# Altium schematic sheet 1_P1.schdoc
size 391 x 645 mm; Symbol: Drawing-Symbol_A4; Device: Drawing-Symbol_A4; @Project Name: Ai-Camera; @Page Count: 2; @Update Date: 2026-02-05; @Create Date: 2025-08-22; @Schematic Name: Schematic1; @Page No: 1; @Page Name: P1; Company: EasyEDA.com; Version: V1.0; Page Size: A4; @Create Time: 04:24:12; @Update Time: 10:58:01; Width: 1500; Height: 2500; Region Start: 1; X Region Count: 6; Y Region Count: 4; Blade Width: 10; Title Block Position: 3; @Board Name: Board1
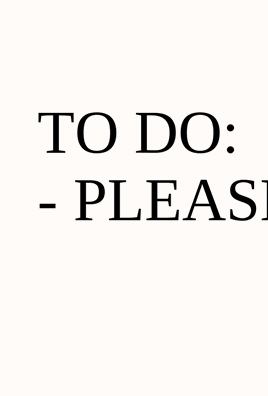
[diagram p0: 1_P1.schdoc, top left]
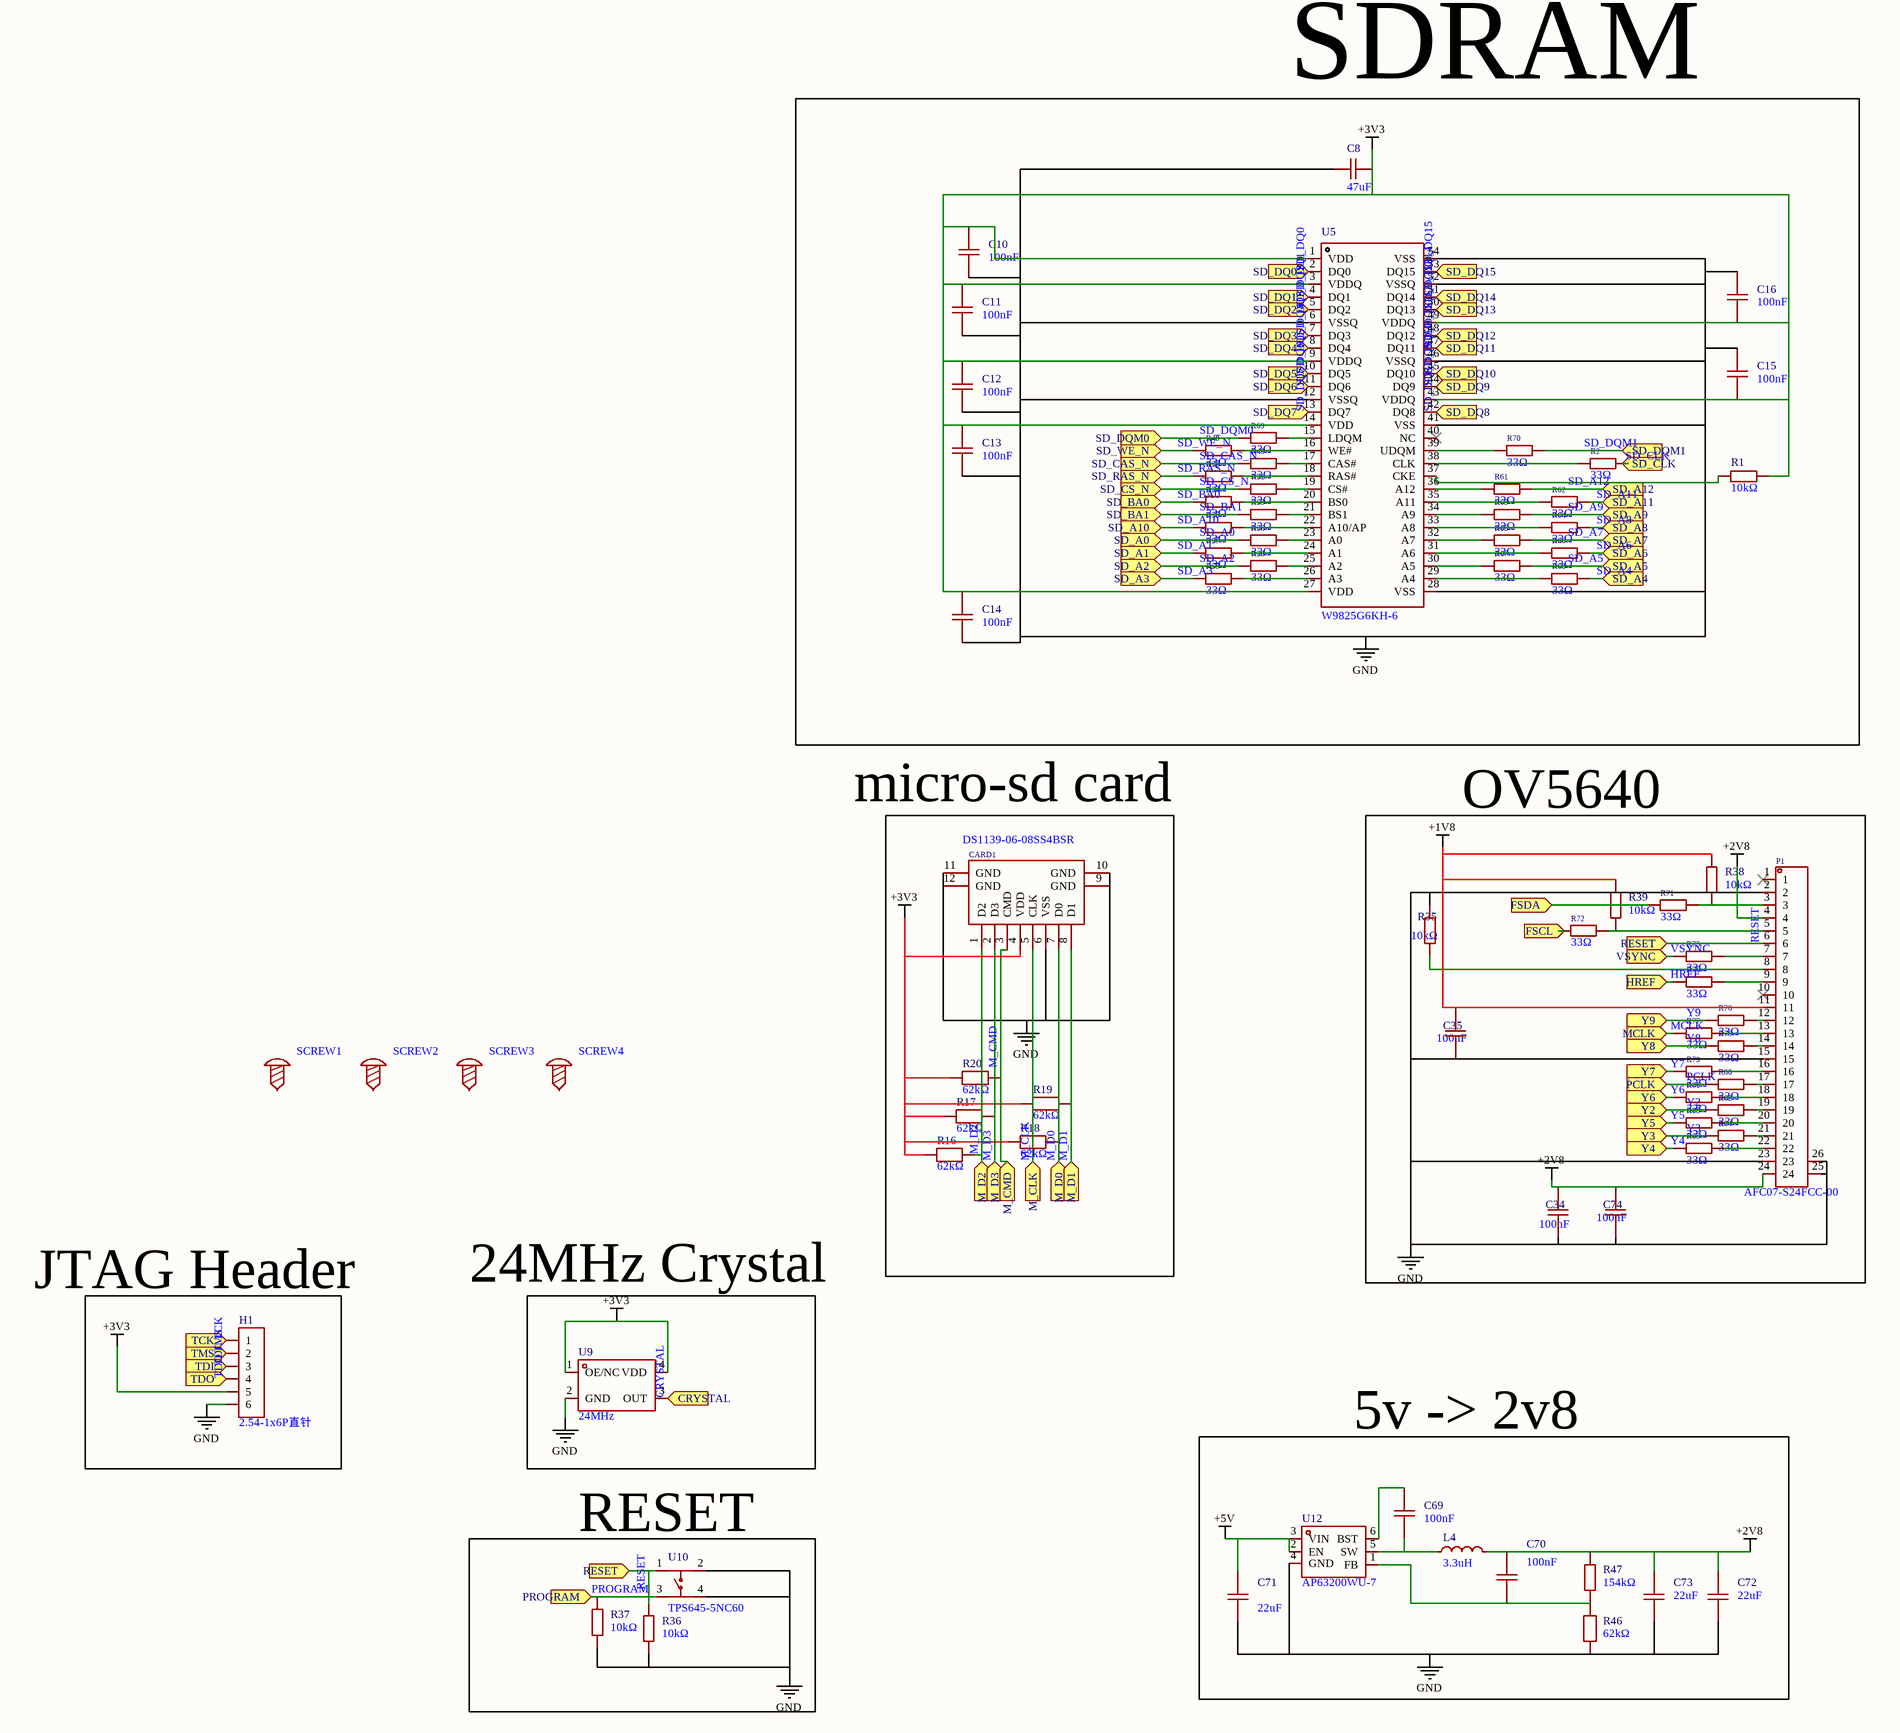
[diagram p1: 1_P1.schdoc, top right]
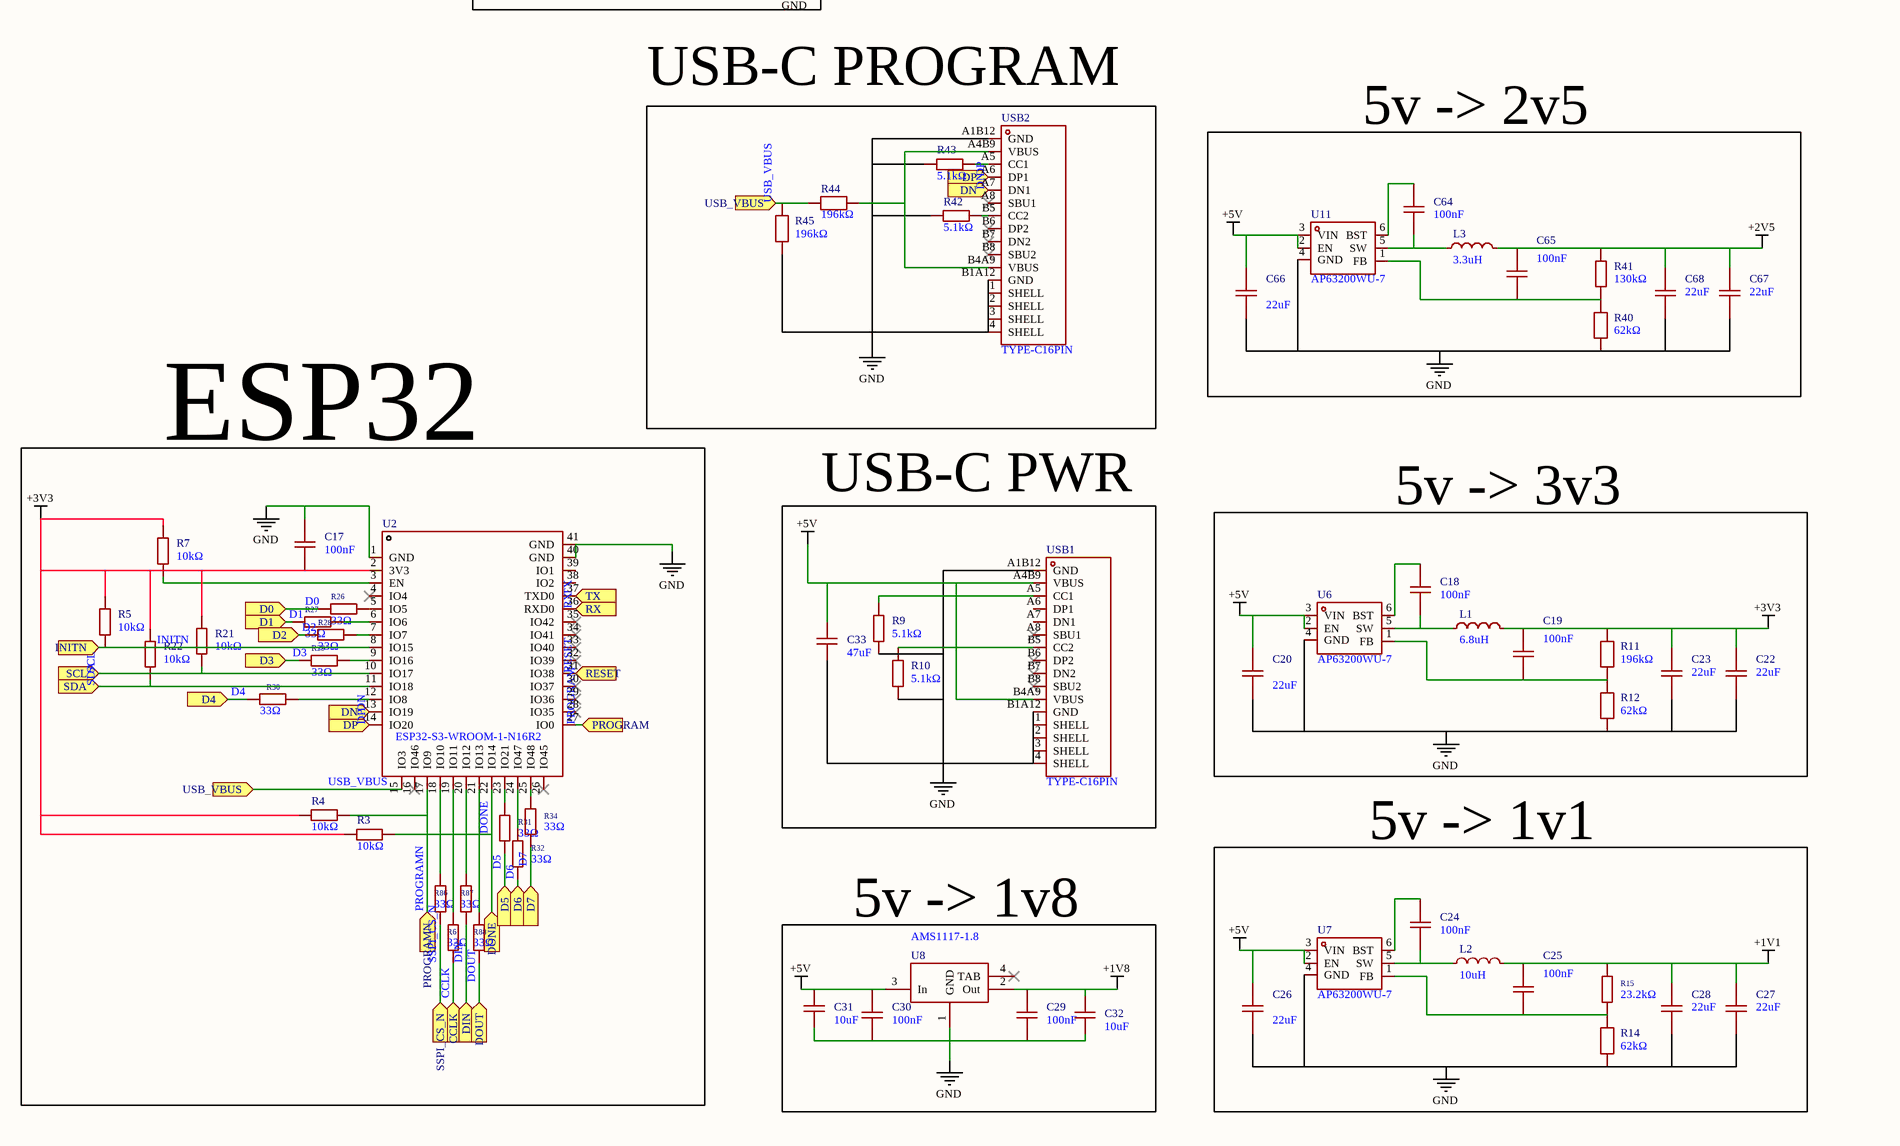
[diagram p2: 1_P1.schdoc, bottom right]

## Parts
C8  47uF  [C0805]
C10  100nF  [C01005]
C11  100nF  [C01005]
C12  100nF  [C01005]
C13  100nF  [C01005]
C14  100nF  [C01005]
C15  100nF  [C01005]
C16  100nF  [C01005]
C17  100nF  [C01005]
C18  100nF  [C01005]
C19  100nF  [C0603]
C20  22uF  [C0603]
C22  22uF  [C0603]
C23  22uF  [C0603]
C24  100nF  [C01005]
C25  100nF  [C0603]
C26  22uF  [C0603]
C27  22uF  [C0603]
C28  22uF  [C0603]
C29  100nF  [C01005]
C30  100nF  [C01005]
C31  10uF  [C0402]
C32  10uF  [C0402]
C33  47uF  [C0805]
C34  100nF  [C01005]
C35  100nF  [C01005]
C64  100nF  [C01005]
C65  100nF  [C0603]
C66  22uF  [C0603]
C67  22uF  [C0603]
C68  22uF  [C0603]
C69  100nF  [C01005]
C70  100nF  [C0603]
C71  22uF  [C0603]
C72  22uF  [C0603]
C73  22uF  [C0603]
C74  100nF  [C01005]
CARD1  DS1139-06-08SS4BSR  [TF-SMD_DS1139-06-08SS4BSR]
H1  2.54-1x6P直针  [HDR-TH_6P-P2.54-V-M-1]
L1  6.8uH  [IND-SMD_L7.0-W6.6]
L2  10uH  [IND-SMD_L7.3-W6.8]
L3  3.3uH  [IND-SMD_L4.5-W4.1_SL0420]
L4  3.3uH  [IND-SMD_L4.5-W4.1_SL0420]
P1  AFC07-S24FCC-00  [FPC-SMD_AFC07-S24FCC-00]
R1  10kΩ  [R0402]
R2  33Ω  [R0402]
R3  10kΩ  [R0402]
R4  10kΩ  [R0402]
R5  10kΩ  [R0402]
R6  33Ω  [R0402]
R7  10kΩ  [R0402]
R9  5.1kΩ  [R0603]
R10  5.1kΩ  [R0603]
R11  196kΩ  [R0603]
R12  62kΩ  [R0603]
R14  62kΩ  [R0603]
R15  23.2kΩ  [R0603]
R16  62kΩ  [R0603]
R17  62kΩ  [R0603]
R18  62kΩ  [R0603]
R19  62kΩ  [R0603]
R20  62kΩ  [R0603]
R21  10kΩ  [R0402]
R22  10kΩ  [R0402]
R26  33Ω  [R0402]
R27  33Ω  [R0402]
R28  33Ω  [R0402]
R29  33Ω  [R0402]
R30  33Ω  [R0402]
R31  33Ω  [R0402]
R32  33Ω  [R0402]
R34  33Ω  [R0402]
R35  10kΩ  [R0402]
R36  10kΩ  [R0402]
R37  10kΩ  [R0402]
R38  10kΩ  [R0402]
R39  10kΩ  [R0402]
R40  62kΩ  [R0603]
R41  130kΩ  [R0402]
R42  5.1kΩ  [R0603]
R43  5.1kΩ  [R0603]
R44  196kΩ  [R0603]
R45  196kΩ  [R0603]
R46  62kΩ  [R0603]
R47  154kΩ  [R0402]
R48  33Ω  [R0402]
R49  33Ω  [R0402]
R50  33Ω  [R0402]
R51  33Ω  [R0402]
R53  33Ω  [R0402]
R54  33Ω  [R0402]
R55  33Ω  [R0402]
R56  33Ω  [R0402]
R57  33Ω  [R0402]
R58  33Ω  [R0402]
R59  33Ω  [R0402]
R61  33Ω  [R0402]
R62  33Ω  [R0402]
R63  33Ω  [R0402]
R64  33Ω  [R0402]
R65  33Ω  [R0402]
R66  33Ω  [R0402]
R67  33Ω  [R0402]
R68  33Ω  [R0402]
R69  33Ω  [R0402]
R70  33Ω  [R0402]
R71  33Ω  [R0402]
R72  33Ω  [R0402]
R73  33Ω  [R0402]
R75  33Ω  [R0402]
R76  33Ω  [R0402]
R77  33Ω  [R0402]
R78  33Ω  [R0402]
R79  33Ω  [R0402]
R80  33Ω  [R0402]
R81  33Ω  [R0402]
R82  33Ω  [R0402]
R83  33Ω  [R0402]
R84  33Ω  [R0402]
R85  33Ω  [R0402]
R86  33Ω  [R0402]
R87  33Ω  [R0402]
R88  33Ω  [R0402]
SCREW1  (no value)  [Screw-Hole-M2]
SCREW2  (no value)  [Screw-Hole-M3]
SCREW3  (no value)  [Screw-Hole-M3]
SCREW4  (no value)  [Screw-Hole-M3]
U2  ESP32-S3-WROOM-1-N16R2  [WIRELM-SMD_ESP32-S3-WROOM-1]
U5  W9825G6KH-6  [TSOP-54_L22.2-W10.2-P0.80-LS11.8-BL]
U6  AP63200WU-7  [SOT-23-6_L2.9-W1.6-P0.95-LS2.8-BR]
U7  AP63200WU-7  [SOT-23-6_L2.9-W1.6-P0.95-LS2.8-BR]
U8  AMS1117-1.8  [SOT-223-4_L6.5-W3.5-P2.30-LS7.0-BR]
U9  24MHz  [OSC-SMD_4P-L3.2-W2.5-BL]
U10  TPS645-5NC60  [SW-SMD_4P-L6.0-W6.0-P4.50-LS9.2]
U11  AP63200WU-7  [SOT-23-6_L2.9-W1.6-P0.95-LS2.8-BR]
U12  AP63200WU-7  [SOT-23-6_L2.9-W1.6-P0.95-LS2.8-BR]
USB1  TYPE-C16PIN  [USB-C-SMD_TYPE-C16PIN]
USB2  TYPE-C16PIN  [USB-C-SMD_TYPE-C16PIN]

## Blocks framed on the sheet
SDRAM: C8 C10-C16 R1 R2 R48-R51 R53-R59 R61-R70 U5
OV5640: C34 C35 C74 P1 R35 R38 R39 R71-R73 R75-R85
5v -> 2v8: C69-C73 L4 R46 R47 U12
RESET: R36 R37 U10
USB-C PROGRAM: R42-R45 USB2
5v -> 2v5: C64-C68 L3 R40 R41 U11
ESP32: C17 R3-R7 R21 R22 R26-R32 R34 R86-R88 U2
USB-C PWR: C33 R9 R10 USB1
5v -> 3v3: C18-C20 C22 C23 L1 R11 R12 U6
5v -> 1v1: C24-C28 L2 R14 R15 U7
5v -> 1v8: C29-C32 U8

## Ports
CCLK (in), CRYSTAL (in), D0 (in), D1 (in), D2 (in), D3 (in), D4 (in), D5 (in), D6 (in), D7 (in), DIN (in), DN (in), DONE (in), DOUT (in), DP (in), FSCL (in), FSDA (in), HREF (in), INITN (in), M_CLK (in), M_CMD (in), M_D0 (in), M_D1 (in), M_D2 (in), M_D3 (in), MCLK (in), PCLK (in), PROGRAM (in), PROGRAMN (in), RESET (in), RX (in), SCL (in), SD_A0 (in), SD_A1 (in), SD_A2 (in), SD_A3 (in), SD_A4 (in), SD_A5 (in), SD_A6 (in), SD_A7 (in), SD_A8 (in), SD_A9 (in), SD_A10 (in), SD_A11 (in), SD_A12 (in), SD_BA0 (in), SD_BA1 (in), SD_CAS_N (in), SD_CLK (in), SD_CS_N (in), SD_DQ0 (in), SD_DQ1 (in), SD_DQ2 (in), SD_DQ3 (in), SD_DQ4 (in), SD_DQ5 (in), SD_DQ6 (in), SD_DQ7 (in), SD_DQ8 (in), SD_DQ9 (in), SD_DQ10 (in), SD_DQ11 (in), SD_DQ12 (in), SD_DQ13 (in), SD_DQ14 (in), SD_DQ15 (in), SD_DQM0 (in), SD_DQM1 (in), SD_RAS_N (in), SD_WE_N (in), SDA (in), SSPI_CS_N (in), TCK (in), TDI (in), TDO (in), TMS (in), TX (in), USB_VBUS (in), VSYNC (in), Y2 (in), Y3 (in), Y4 (in), Y5 (in), Y6 (in), Y7 (in), Y8 (in), Y9 (in)

## Nets
+1V1: C25.2 C27.2 C28.2 L2.2 R15.2
+1V8: C29.1 C32.2 C35.1 P1.11 R38.2 R39.2 U8.2(Out)
+2V5: C65.2 C67.2 C68.2 L3.2 R41.2
+2V8: C34.1 C70.2 C72.2 C73.2 C74.1 L4.2 P1.4 P1.24 R47.2
+3V3: C8.1 C10.1 C11.1 C12.1 C13.1 C14.1 C15.2 C16.2 C17.2 C19.2 C22.2 C23.2 CARD1.4(VDD) H1.5 L1.2 R1.2 R3.1 R4.1 R5.2 R7.2 R11.2 R16.2 R17.2 R18.2 R19.2 R20.2 R21.2 R22.2 U2.2(3V3) U5.1(VDD) U5.3(VDDQ) U5.9(VDDQ) U5.14(VDD) U5.27(VDD) U5.43(VDDQ) U5.49(VDDQ) U9.1(OE/NC) U9.4(VDD)
+5V: C20.2 C26.2 C30.1 C31.2 C33.2 C66.2 C71.2 U6.2(EN) U6.3(VIN) U7.2(EN) U7.3(VIN) U8.3(In) U11.2(EN) U11.3(VIN) U12.2(EN) U12.3(VIN) USB1.A4B9(VBUS) USB1.B4A9(VBUS)
GND: C8.2 C10.2 C11.2 C12.2 C13.2 C14.2 C15.1 C16.1 C17.1 C20.1 C22.1 C23.1 C26.1 C27.1 C28.1 C33.1 C34.2 C35.2 C66.1 C67.1 C68.1 C71.1 C72.1 C73.1 C74.2 CARD1.6(VSS) CARD1.9(GND) CARD1.10(GND) CARD1.11(GND) CARD1.12(GND) H1.6 P1.2 P1.15 P1.23 P1.25 P1.26 R9.1 R10.1 R12.1 R14.1 R35.2 R36.2 R37.2 R40.1 R42.2 R43.2 R45.1 R46.1 U2.1(GND) U2.40(GND) U2.41(GND) U5.6(VSSQ) U5.12(VSSQ) U5.28(VSS) U5.41(VSS) U5.46(VSSQ) U5.52(VSSQ) U5.54(VSS) U6.4(GND) U7.4(GND) U8.1(GND) U9.2(GND) U10.2 U10.4 U11.4(GND) U12.4(GND) USB1.1(SHELL) USB1.2(SHELL) USB1.3(SHELL) USB1.4(SHELL) USB1.A1B12(GND) USB1.B1A12(GND) USB2.1(SHELL) USB2.2(SHELL) USB2.3(SHELL) USB2.4(SHELL) USB2.A1B12(GND) USB2.B1A12(GND)
CCLK: R6.1 ; port CCLK
CRYSTAL: U9.3(OUT) ; port CRYSTAL
D0: R26.1 ; port D0
D1: R27.1 ; port D1
D2: R28.1 ; port D2
D3: R29.1 ; port D3
D4: R30.1 ; port D4
D5: R31.1 ; port D5
D6: R32.1 ; port D6
D7: R34.1 ; port D7
DIN: R87.1 ; port DIN
DN: U2.13(IO19) USB2.A7(DN1) ; port DN
DONE: R3.2 U2.22(IO14) ; port DONE
DOUT: R88.1 ; port DOUT
DP: U2.14(IO20) USB2.A6(DP1) ; port DP
FSCL: R72.1 ; port FSCL
FSDA: R71.1 ; port FSDA
HREF: R75.1 ; port HREF
INITN: R5.1 U2.8(IO15) ; port INITN
M_CLK: CARD1.5(CLK) ; port M_CLK
M_CMD: CARD1.3(CMD) R20.1 ; port M_CMD
M_D0: CARD1.7(D0) R18.1 ; port M_D0
M_D1: CARD1.8(D1) R19.1 ; port M_D1
M_D2: CARD1.1(D2) R16.1 ; port M_D2
M_D3: CARD1.2(D3) R17.1 ; port M_D3
MCLK: R77.1 ; port MCLK
PCLK: R80.1 ; port PCLK
PROGRAM: R37.1 U2.27(IO0) U10.3 ; port PROGRAM
PROGRAMN: R4.2 U2.17(IO9) ; port PROGRAMN
RESET: P1.6 R36.1 U2.31(IO38) U10.1 ; port RESET
RX: U2.36(RXD0) ; port RX
SCL: R21.1 U2.10(IO17) ; port SCL
SD_A0: R56.1 ; port SD_A0
SD_A1: R57.1 ; port SD_A1
SD_A2: R58.1 ; port SD_A2
SD_A3: R59.1 ; port SD_A3
SD_A4: R68.2 ; port SD_A4
SD_A5: R67.2 ; port SD_A5
SD_A6: R66.2 ; port SD_A6
SD_A7: R65.2 ; port SD_A7
SD_A8: R64.2 ; port SD_A8
SD_A9: R63.2 ; port SD_A9
SD_A10: R55.1 ; port SD_A10
SD_A11: R62.2 ; port SD_A11
SD_A12: R61.2 ; port SD_A12
SD_BA0: R54.1 ; port SD_BA0
SD_BA1: R53.1 ; port SD_BA1
SD_CAS_N: R49.1 ; port SD_CAS_N
SD_CLK: R2.2 ; port SD_CLK
SD_CS_N: R51.1 ; port SD_CS_N
SD_DQ0: U5.2(DQ0) ; port SD_DQ0
SD_DQ1: U5.4(DQ1) ; port SD_DQ1
SD_DQ2: U5.5(DQ2) ; port SD_DQ2
SD_DQ3: U5.7(DQ3) ; port SD_DQ3
SD_DQ4: U5.8(DQ4) ; port SD_DQ4
SD_DQ5: U5.10(DQ5) ; port SD_DQ5
SD_DQ6: U5.11(DQ6) ; port SD_DQ6
SD_DQ7: U5.13(DQ7) ; port SD_DQ7
SD_DQ8: U5.42(DQ8) ; port SD_DQ8
SD_DQ9: U5.44(DQ9) ; port SD_DQ9
SD_DQ10: U5.45(DQ10) ; port SD_DQ10
SD_DQ11: U5.47(DQ11) ; port SD_DQ11
SD_DQ12: U5.48(DQ12) ; port SD_DQ12
SD_DQ13: U5.50(DQ13) ; port SD_DQ13
SD_DQ14: U5.51(DQ14) ; port SD_DQ14
SD_DQ15: U5.53(DQ15) ; port SD_DQ15
SD_DQM0: R69.1 ; port SD_DQM0
SD_DQM1: R70.2 ; port SD_DQM1
SD_RAS_N: R50.1 ; port SD_RAS_N
SD_WE_N: R48.1 ; port SD_WE_N
SDA: R22.1 U2.11(IO18) ; port SDA
SSPI_CS_N: R86.1 ; port SSPI_CS_N
TCK: H1.1 ; port TCK
TDI: H1.3 ; port TDI
TDO: H1.4 ; port TDO
TMS: H1.2 ; port TMS
TX: U2.37(TXD0) ; port TX
USB_VBUS: R44.1 R45.2 U2.15(IO3) ; port USB_VBUS
VSYNC: R73.1 ; port VSYNC
Y2: R82.1 ; port Y2
Y3: R84.1 ; port Y3
Y4: R85.1 ; port Y4
Y5: R83.1 ; port Y5
Y6: R81.1 ; port Y6
Y7: R79.1 ; port Y7
Y8: R78.1 ; port Y8
Y9: R76.1 ; port Y9
NetC18_1: C18.1 U6.6(BST)
NetC18_2: C18.2 L1.1 U6.5(SW)
NetC19_1: C19.1 R11.1 R12.2 U6.1(FB)
NetC24_1: C24.1 U7.6(BST)
NetC24_2: C24.2 L2.1 U7.5(SW)
NetC25_1: C25.1 R14.2 R15.1 U7.1(FB)
NetC29_2: C29.2 C30.2 C31.1 C32.1
NetC64_1: C64.1 U11.6(BST)
NetC64_2: C64.2 L3.1 U11.5(SW)
NetC65_1: C65.1 R40.2 R41.1 U11.1(FB)
NetC69_1: C69.1 U12.6(BST)
NetC69_2: C69.2 L4.1 U12.5(SW)
NetC70_1: C70.1 R46.2 R47.1 U12.1(FB)
NetP1_3: P1.3 R38.1 R71.2
NetP1_5: P1.5 R39.1 R72.2
NetP1_7: P1.7 R73.2
NetP1_8: P1.8 R35.1
NetP1_9: P1.9 R75.2
NetP1_12: P1.12 R76.2
NetP1_13: P1.13 R77.2
NetP1_14: P1.14 R78.2
NetP1_16: P1.16 R79.2
NetP1_17: P1.17 R80.2
NetP1_18: P1.18 R81.2
NetP1_19: P1.19 R82.2
NetP1_20: P1.20 R83.2
NetP1_21: P1.21 R84.2
NetP1_22: P1.22 R85.2
NetR1_1: R1.1 U5.37(CKE)
NetR2_1: R2.1 U5.38(CLK)
NetR6_2: R6.2 U2.19(IO11)
NetR7_1: R7.1 U2.3(EN)
NetR9_2: R9.2 USB1.A5(CC1)
NetR10_2: R10.2 USB1.B5(CC2)
NetR26_2: R26.2 U2.5(IO5)
NetR27_2: R27.2 U2.6(IO6)
NetR28_2: R28.2 U2.7(IO7)
NetR29_2: R29.2 U2.9(IO16)
NetR30_2: R30.2 U2.12(IO8)
NetR31_2: R31.2 U2.23(IO21)
NetR32_2: R32.2 U2.24(IO47)
NetR34_2: R34.2 U2.25(IO48)
NetR42_1: R42.1 USB2.B5(CC2)
NetR43_1: R43.1 USB2.A5(CC1)
NetR44_2: R44.2 USB2.A4B9(VBUS) USB2.B4A9(VBUS)
NetR48_2: R48.2 U5.16(WE#)
NetR49_2: R49.2 U5.17(CAS#)
NetR50_2: R50.2 U5.18(RAS#)
NetR51_2: R51.2 U5.19(CS#)
NetR53_2: R53.2 U5.21(BS1)
NetR54_2: R54.2 U5.20(BS0)
NetR55_2: R55.2 U5.22(A10/AP)
NetR56_2: R56.2 U5.23(A0)
NetR57_2: R57.2 U5.24(A1)
NetR58_2: R58.2 U5.25(A2)
NetR59_2: R59.2 U5.26(A3)
NetR61_1: R61.1 U5.36(A12)
NetR62_1: R62.1 U5.35(A11)
NetR63_1: R63.1 U5.34(A9)
NetR64_1: R64.1 U5.33(A8)
NetR65_1: R65.1 U5.32(A7)
NetR66_1: R66.1 U5.31(A6)
NetR67_1: R67.1 U5.30(A5)
NetR68_1: R68.1 U5.29(A4)
NetR69_2: R69.2 U5.15(LDQM)
NetR70_1: R70.1 U5.39(UDQM)
NetR86_2: R86.2 U2.18(IO10)
NetR87_2: R87.2 U2.20(IO12)
NetR88_2: R88.2 U2.21(IO13)

Not connected (* = marked no-connect by the designer): P1 1* 10*; SCREW1 1; SCREW2 1; SCREW3 1; SCREW4 1; U2 4(IO4)* 16(IO46)* 26(IO45)* 28(IO35)* 29(IO36)* 30(IO37)* 32(IO39)* 33(IO40)* 34(IO41)* 35(IO42)* 38(IO2) 39(IO1); U5 40(NC)*; U8 4(TAB)*; USB1 A6(DP1) A7(DN1) A8(SBU1)* B6(DP2)* B7(DN2)* B8(SBU2)*; USB2 A8(SBU1)* B6(DP2)* B7(DN2)* B8(SBU2)*

## Notes on the sheet
- TO DO:
  - PLEASE CHECK THE POWER ON FPGA
- micro-sd card
- (near H1) JTAG Header
- 24MHz Crystal
- 1
- 2
- 3
- 4
- 5
- 6
- A
- B
- C
- D
- Schematic
- Schematic1
- Create at
- Update at
- 2025-08-22
- 2026-02-05
- Board
- Drawn
- Board1
- Page
- P1
- Reviewed
- Version
- Size
- Ai-Camera
- Page  1  Total  2
- V1.0
- A4
- EasyEDA.com

## Library data of the parts
C8 C33 = CL21A476MQYNNNE: Manufacturer: SAMSUNG(三星); Add into BOM: yes; Tolerance: ±20%; Voltage Rating: 6.3V; Temperature Coefficient: X5R; Symbol: CL21A476MQYNNNE; Device: CL21A476MQYNNNE; LCSC Part Name: 47uF ±20% 6.3V; Supplier Part: C16780; Manufacturer Part: CL21A476MQYNNNE; Supplier Footprint: 0805; JLCPCB Part Class: Basic Part; Datasheet: https://item.szlcsc.com/datasheet/CL21A476MQYNNNE/17464.html; Supplier: LCSC; Convert to PCB: yes; Value: 47uF
C10-C18 C24 C29 C30 C34 C35 C64 C69 C74 = GRM022R60J104KE15D: Manufacturer: muRata(村田); Add into BOM: yes; Tolerance: ±10%; Voltage Rating: 6.3V; Temperature Coefficient: X5R; Symbol: GRM022R60J104KE15D; Device: GRM022R60J104KE15D; LCSC Part Name: 100nF ±10% 6.3V; Supplier Part: C161362; Manufacturer Part: GRM022R60J104KE15D; Supplier Footprint: 01005; JLCPCB Part Class: Extended Part; Datasheet: https://atta.szlcsc.com/upload/public/pdf/source/20200305/C490387_23319AE8C154DEB24C505E6C82A8106A.pdf; Supplier: LCSC; Convert to PCB: yes; Value: 100nF
C19 C25 C65 C70 = TCC0603X7R104K500CT: Manufacturer: CCTC(三环); Add into BOM: yes; Tolerance: ±10%; Voltage Rating: 50V; Temperature Coefficient: X7R; Symbol: TCC0603X7R104K500CT; Device: TCC0603X7R104K500CT; LCSC Part Name: 100nF ±10% 50V; Supplier Part: C282519; Manufacturer Part: TCC0603X7R104K500CT; Supplier Footprint: 0603; JLCPCB Part Class: Extended Part; Datasheet: https://item.szlcsc.com/datasheet/TCC0603X7R104K500CT/268639.html; Supplier: LCSC; Convert to PCB: yes; Value: 100nF
C20 C22 C23 C26-C28 C66-C68 C71-C73 = TCC0603X5R226M6R3CT: Manufacturer: CCTC(三环); Add into BOM: yes; Tolerance: ±20%; Voltage Rating: 6.3V; Temperature Coefficient: X5R; Symbol: TCC0603X5R226M6R3CT; Device: TCC0603X5R226M6R3CT; LCSC Part Name: 22uF ±20% 6.3V; Supplier Part: C380323; Manufacturer Part: TCC0603X5R226M6R3CT; Supplier Footprint: 0603; JLCPCB Part Class: Extended Part; Datasheet: https://item.szlcsc.com/datasheet/TCC0603X5R226M6R3CT/352728.html; Supplier: LCSC; Convert to PCB: yes; Value: 22uF
C31 C32 = GRM155R60J106ME44D: Manufacturer: muRata(村田); Add into BOM: yes; Tolerance: ±20%; Voltage Rating: 6.3V; Temperature Coefficient: X5R; Symbol: GRM155R60J106ME44D; Device: GRM155R60J106ME44D; LCSC Part Name: 10uF ±20% 6.3V; Supplier Part: C76991; Manufacturer Part: GRM155R60J106ME44D; Supplier Footprint: 0402; JLCPCB Part Class: Extended Part; Datasheet: https://item.szlcsc.com/datasheet/GRM155R60J106ME44D/78118.html; Supplier: LCSC; Convert to PCB: yes; Value: 10uF
CARD1 = DS1139-06-08SS4BSR: Manufacturer: CONNFLY; Add into BOM: yes; Card Connection Mode: Hinged Lid; Card Type: MicroSD Card (TF Card); Connector Type: Connector and Ejector; Symbol: DS1139-06-08SS4BSR; Device: DS1139-06-08SS4BSR; Supplier: LCSC; Manufacturer Part: DS1139-06-08SS4BSR; Supplier Part: C86574; JLCPCB Part Class: Extended Part; LCSC Part Name: 翻盖式 MicroSD卡(TF卡) 卡座; Supplier Footprint: SMD; Datasheet: https://item.szlcsc.com/datasheet/DS1139-06-08SS4BSR/87751.html; Convert to PCB: yes; Height Above Board: -; Operating Temperature: -
H1 = 2.54-1x6P直针: Manufacturer: BOOMELE(博穆精密); Symbol: Header-Male-2.54_1x6; Add into BOM: yes; Pin Structure: 1x6P; Pitch: 2.54mm; Circluar Pins/Square Pins: Pin Header; Current Rating: 3A; Device: 2.54-1x6P直针; LCSC Part Name: 1x6P 间距:2.54mm 方针 直插; Supplier Part: C37208; Manufacturer Part: 2.54-1x6P直针; Supplier Footprint: 插件,P=2.54mm; JLCPCB Part Class: Extended Part; Datasheet: https://item.szlcsc.com/datasheet/2.54-1x6P%25E7%259B%25B4%25E9%2592%2588/38187.html; Supplier: LCSC; Convert to PCB: yes; Row Spacing: -; Mounting Type: Through Hole; Number of Rows: 1; Number of Pins: 6P; Voltage Rating (Max): -; Length of Mating Pin: 6mm; Insulation Height: 2.5mm; Length of End Connection Pin: 3mm; Contact Material: Brass; Contact Plating: Gold; Operating Temperature: -40℃~+105℃; Color: Black
L1 = FXL0630-6R8-M: Manufacturer: cjiang(长江微电); Add into BOM: yes; Tolerance: ±20%; Current Rating: 5A; Current - Saturation(Isat): 6A; DC Resistance(DCR): 48mΩ; Type: Molded Inductor; Symbol: FXL0630-6R8-M; Device: FXL0630-6R8-M; LCSC Part Name: 6.8uH ±20% 6A; Supplier Part: C167221; Manufacturer Part: FXL0630-6R8-M; Supplier Footprint: SMD,7x6.6mm; JLCPCB Part Class: Extended Part; Datasheet: https://item.szlcsc.com/datasheet/FXL0630-6R8-M/178604.html; Supplier: LCSC; Convert to PCB: yes; Value: 6.8uH
L2 = FXL0630-100-M: Manufacturer: cjiang(长江微电); Add into BOM: yes; Tolerance: ±20%; Saturation Current (Isat): 5.5A; Type: Integrated molded inductor; Symbol: FXL0630-100-M; Device: FXL0630-100-M; LCSC Part Name: 10uH ±20% 5.5A; Supplier Part: C167223; Manufacturer Part: FXL0630-100-M; Supplier Footprint: SMD,6.6x7mm; JLCPCB Part Class: Extended Part; Datasheet: https://atta.szlcsc.com/upload/public/pdf/source/20240426/3189EA8206330E2108542F9E34E540E7.pdf; Supplier: LCSC; Convert to PCB: yes; Value: 10uH; Ratings: -
L3 L4 = SL0420-3R3M: Manufacturer: 台湾陆海; Add into BOM: yes; Tolerance: ±20%; Current Rating: 3.5A; Current - Saturation (Isat): 4A; Symbol: SL0420-3R3M; Device: SL0420-3R3M; LCSC Part Name: 3.3uH ±20% 4A; Supplier Part: C22463807; Manufacturer Part: SL0420-3R3M; Supplier Footprint: SMD,4.5x4.1mm; JLCPCB Part Class: Extended Part; Datasheet: https://item.szlcsc.com/datasheet/SL0420-3R3M/24154949.html; Supplier: LCSC; Convert to PCB: yes; Value: 3.3uH
P1 = AFC07-S24FCC-00: Manufacturer: JS(钜硕电子); Symbol: FPC 0.5MM 24P Pull type H2.0mm Under the next; Add into BOM: yes; Locking Feature: Slide Lock; Number of Contacts: 24P; Pitch: 0.5mm; FFC, FCB Thickness: 0.3mm; Device: AFC07-S24FCC-00; Supplier: LCSC; Manufacturer Part: AFC07-S24FCC-00; Supplier Part: C11057; JLCPCB Part Class: Extended Part; LCSC Part Name: 间距:0.5mm P数:24P 抽屉式 下接; Supplier Footprint: SMD,P=0.5mm,卧贴; Datasheet: https://item.szlcsc.com/datasheet/AFC07-S24FCC-00/11604.html; Convert to PCB: yes; Contact Type: Bottom Contact; Mounting Type: Surface Mount, Right Angle; Height Above Board: 2mm
R1 R3-R5 R7 R21 R22 R35-R39 = 0402WGF1002TCE: Manufacturer: UNI-ROYAL(厚声); Add into BOM: yes; Tolerance: ±1%; Power(Watts): 62.5mW; Voltage-Supply(Max): 50V; Temperature Coefficient: ±100ppm/℃; Symbol: 0402WGF1002TCE; Device: 0402WGF1002TCE; LCSC Part Name: 10kΩ ±1% 62.5mW 厚膜电阻; Supplier Part: C25744; Manufacturer Part: 0402WGF1002TCE; Supplier Footprint: 0402; JLCPCB Part Class: Basic Part; Datasheet: https://item.szlcsc.com/datasheet/0402WGF1002TCE/26487.html; Supplier: LCSC; Convert to PCB: yes; Type: Thick Film Resistor; Value: 10kΩ; Operating Temperature: -55℃~+155℃
R2 R6 R26-R32 R34 R48-R51 R53-R59 R61-R73 R75-R88 = 0402WGF330JTCE: Manufacturer: UNI-ROYAL(厚声); Add into BOM: yes; Tolerance: ±1%; Power(Watts): 62.5mW; Voltage-Supply(Max): 50V; Temperature Coefficient: ±100ppm/℃; Symbol: 0402WGF330JTCE; Device: 0402WGF330JTCE; Supplier: LCSC; Manufacturer Part: 0402WGF330JTCE; Supplier Part: C25105; Value: 33Ω; JLCPCB Part Class: Basic Part; LCSC Part Name: 33Ω ±1% 62.5mW 厚膜电阻; Supplier Footprint: 0402; Datasheet: https://item.szlcsc.com/datasheet/0402WGF330JTCE/25848.html; Convert to PCB: yes; Type: Thick Film Resistor; Operating Temperature: -55℃~+155℃
R9 R10 R42 R43 = 0603WAF5101T5E: Manufacturer: UNI-ROYAL(厚声); Add into BOM: yes; Tolerance: ±1%; Power(Watts): 100mW; Voltage-Supply(Max): 75V; Temperature Coefficient: ±100ppm/℃; Symbol: 0603WAF5101T5E; Device: 0603WAF5101T5E; LCSC Part Name: 5.1kΩ ±1% 100mW 厚膜电阻; Supplier Part: C23186; Manufacturer Part: 0603WAF5101T5E; Supplier Footprint: 0603; JLCPCB Part Class: Basic Part; Datasheet: https://item.szlcsc.com/datasheet/0603WAF5101T5E/23913.html; Supplier: LCSC; Convert to PCB: yes; Type: Thick Film Resistor; Value: 5.1kΩ; Operating Temperature: -55℃~+155℃
R11 R44 R45 = FRC0603F1963TS: Manufacturer: FOJAN(富捷); Add into BOM: yes; Tolerance: ±1%; Power(Watts): 100mW; Voltage-Supply(Max): 75V; Temperature Coefficient: ±100ppm/℃; Symbol: FRC0603F1963TS; Device: FRC0603F1963TS; LCSC Part Name: 196kΩ ±1% 100mW 厚膜电阻; Supplier Part: C2974032; Manufacturer Part: FRC0603F1963TS; Supplier Footprint: 0603; JLCPCB Part Class: Extended Part; Supplier: LCSC; Convert to PCB: yes; Type: Thick Film Resistor; Value: 196kΩ; Operating Temperature: -55℃~+155℃
R12 R14 R16-R20 R40 R46 = FRC0603F6202TS: Manufacturer: FOJAN(富捷); Add into BOM: yes; Tolerance: ±1%; Power(Watts): 100mW; Voltage-Supply(Max): 75V; Temperature Coefficient: ±100ppm/℃; Symbol: FRC0603F6202TS; Device: FRC0603F6202TS; LCSC Part Name: 62kΩ ±1% 100mW 厚膜电阻; Supplier Part: C2907059; Manufacturer Part: FRC0603F6202TS; Supplier Footprint: 0603; JLCPCB Part Class: Extended Part; Supplier: LCSC; Convert to PCB: yes; Type: Thick Film Resistor; Value: 62kΩ; Operating Temperature: -55℃~+155℃
R15 = 0603WAF2322T5E: Manufacturer: UNI-ROYAL(厚声); Add into BOM: yes; Tolerance: ±1%; Power(Watts): 100mW; Voltage-Supply(Max): 75V; Temperature Coefficient: ±100ppm/℃; Symbol: 0603WAF2322T5E; Device: 0603WAF2322T5E; Supplier: LCSC; Manufacturer Part: 0603WAF2322T5E; Supplier Part: C23346; Value: 23.2kΩ; JLCPCB Part Class: Extended Part; LCSC Part Name: 23.2kΩ ±1% 100mW 厚膜电阻; Supplier Footprint: 0603; Datasheet: https://item.szlcsc.com/datasheet/0603WAF2322T5E/24079.html; Convert to PCB: yes; Type: Thick Film Resistor; Operating Temperature: -55℃~+155℃
R41 = RC0402FR-07130KL: Manufacturer: YAGEO(国巨); Add into BOM: yes; Tolerance: ±1%; Power(Watts): 62.5mW; Voltage-Supply(Max): 50V; Temperature Coefficient: ±100ppm/℃; Symbol: RC0402FR-07130KL; Device: RC0402FR-07130KL; LCSC Part Name: 厚膜电阻 130kΩ ±1% 62.5mW; Supplier Part: C93946; Manufacturer Part: RC0402FR-07130KL; Supplier Footprint: 0402; JLCPCB Part Class: Extended Part; Datasheet: https://item.szlcsc.com/datasheet/RC0402FR-07130KL/95144.html; Supplier: LCSC; Convert to PCB: yes; Type: Thick Film Resistor; Value: 130kΩ; Operating Temperature: -55℃~+155℃
R47 = 0402WGF1543TCE: Manufacturer: UNI-ROYAL(厚声); Add into BOM: yes; Tolerance: ±1%; Power(Watts): 62.5mW; Voltage-Supply(Max): 50V; Temperature Coefficient: ±100ppm/℃; Symbol: 0402WGF1543TCE; Device: 0402WGF1543TCE; LCSC Part Name: 154kΩ ±1% 62.5mW 厚膜电阻; Supplier Part: C26993; Manufacturer Part: 0402WGF1543TCE; Supplier Footprint: 0402; JLCPCB Part Class: Extended Part; Datasheet: https://item.szlcsc.com/datasheet/0402WGF1543TCE/27742.html; Supplier: LCSC; Convert to PCB: yes; Type: Thick Film Resistor; Value: 154kΩ; Operating Temperature: -55℃~+155℃
SCREW1 = Screw-Hole-M2: Add into BOM: yes; Symbol: Screw-Hole; Device: Screw-Hole-M2; Convert to PCB: yes; Supplier Footprint: 插件
SCREW2-SCREW4 = Screw-Hole-M3: Convert to PCB: yes; Symbol: Screw-Hole; Device: Screw-Hole-M3; Add into BOM: yes; Supplier Footprint: 插件
U2 = ESP32-S3-WROOM-1-N16R2: Manufacturer: ESPRESSIF(乐鑫); Symbol: ESP32-S3-WROOM-1(N16R2); Add into BOM: yes; Device: ESP32-S3-WROOM-1-N16R2; LCSC Part Name: 通用型Wi-Fi+低功耗蓝牙MCU模组; Supplier Part: C2913205; Manufacturer Part: ESP32-S3-WROOM-1-N16R2; Supplier Footprint: SMD,25.5x18mm; JLCPCB Part Class: Extended Part; Datasheet: https://item.szlcsc.com/datasheet/ESP32-S3-WROOM-1-N16R2/3198303.html; Supplier: LCSC; Convert to PCB: yes
U5 = W9825G6KH-6: Manufacturer: Winbond(华邦); Add into BOM: yes; Memory Size: 256Mbit; Clock Frequency: 166MHz; Voltage - Supply: 3V~3.6V; Symbol: W9825G6KH-6; Device: W9825G6KH-6; LCSC Part Name: 4M×4存储体×16位SDRAM; Supplier Part: C62246; Manufacturer Part: W9825G6KH-6; Supplier Footprint: TSOP-54-10.2mm; JLCPCB Part Class: Extended Part; Datasheet: https://item.szlcsc.com/datasheet/W9825G6KH-6/63303.html; Supplier: LCSC; Convert to PCB: yes; Operating Temperature: 0℃~+70℃
U6 U7 U11 U12 = AP63200WU-7: Manufacturer: DIODES(美台); Add into BOM: yes; Function: Buck; Voltage - Supply: 3.8V~32V; Output Current: 2A; Frequency - Switching: 500kHz; Number of Outputs: 1; Quiescent Current: 22uA; Switch tube (built-in/external): Built-In; Output Type: Adjustable; Symbol: AP63200WU-7; Device: AP63200WU-7; LCSC Part Name: 3.8V至32V输入、2A低静态电流同步降压转换器，增强EMI抑制; Supplier Part: C2071868; Manufacturer Part: AP63200WU-7; Supplier Footprint: TSOT-23-6; JLCPCB Part Class: Extended Part; Datasheet: https://item.szlcsc.com/datasheet/AP63200WU-7/2163451.html; Supplier: LCSC; Convert to PCB: yes; Output Voltage: -; Operating Temperature: -40℃~+85℃; Synchronous Rectifier: Yes; Topology: Buck
U8 = AMS1117-1.8_C6185: Manufacturer: AMS; Add into BOM: yes; Output Type: Fixed; Voltage - Supply: 15V; Output Voltage: 1.8V; Output Current: 1A; Power Supply Rejection Ratio (PSRR): 72dB@(120Hz); Voltage Dropout: 1.3V@(1A); Noise: 0.003%Vout; Output Configuration: Positive; Number of Outputs: 1; Symbol: AMS1117-1.8; Device: AMS1117-1.8_C6185; LCSC Part Name: 输入15V 输出1.8V 1A; Supplier Part: C6185; Manufacturer Part: AMS1117-1.8; Supplier Footprint: SOT-223; JLCPCB Part Class: Extended Part; Datasheet: https://item.szlcsc.com/datasheet/AMS1117-1.8/6651.html; Supplier: LCSC; Convert to PCB: yes; Operating Temperature: -40℃~+125℃@(Tj)
U9 = XOS32024000LT00351005: Manufacturer: 同晶; Add into BOM: yes; Normal temperature Frequency Tolerance: ±10ppm; Output Type: CMOS; Voltage - Supply: 1.62V~3.63V; Current - Supply: 5mA; Frequency Stability: ±20ppm; Symbol: XOS32024000LT00351005; Device: XOS32024000LT00351005; LCSC Part Name: 24MHz 4P 3225 1.8V-3.3V ±10PPM -40~85℃ (±20PPM) CMOS; Supplier Part: C37635416; Manufacturer Part: XOS32024000LT00351005; Supplier Footprint: SMD3225-4P; JLCPCB Part Class: Extended Part; Datasheet: https://item.szlcsc.com/datasheet/XOS32024000LT00351005/39361348.html; Supplier: LCSC; Convert to PCB: yes; Value: 24MHz; Operating Temperature: -40℃~+85℃
U10 = TPS645-5NC60: Manufacturer: ROCPU Switches(台普); Add into BOM: yes; Symbol: TPS645-5NC60; Device: TPS645-5NC60; LCSC Part Name: 6X6X6H 260克力 贴片轻触开关; Supplier Part: C19191552; Manufacturer Part: TPS645-5NC60; Supplier Footprint: -; JLCPCB Part Class: Extended Part; Datasheet: https://atta.szlcsc.com/upload/public/pdf/source/20231204/193B3ACAB5A471A76A9359FBA22C7A2C.pdf; Supplier: LCSC; Convert to PCB: yes
USB1 USB2 = TYPE-C16PIN: Manufacturer: SHOU HAN(首韩); Add into BOM: yes; Connector Type: Type-C; Protocol Standard: USB 3.1; Gender: Female; Number of Contacts: 16P; Number of Ports: 1; Current Rating-Power: 3A; Voltage Rating: 30V; Connect-Disconnect Life: 10,000 Cycles; Detection color: Black; Symbol: TYPE-C16PIN; Device: TYPE-C16PIN; LCSC Part Name: Type-C 母 卧贴; Supplier Part: C393939; Manufacturer Part: TYPE-C16PIN; Supplier Footprint: SMD; JLCPCB Part Class: Extended Part; Datasheet: https://item.szlcsc.com/datasheet/TYPE-C16PIN/372551.html; Supplier: LCSC; Convert to PCB: yes; Mounting Type: Surface Mount, Right Angle; Operating Temperature: -40℃~+85℃